# Altium project BPD597302-50M.PrjPcb
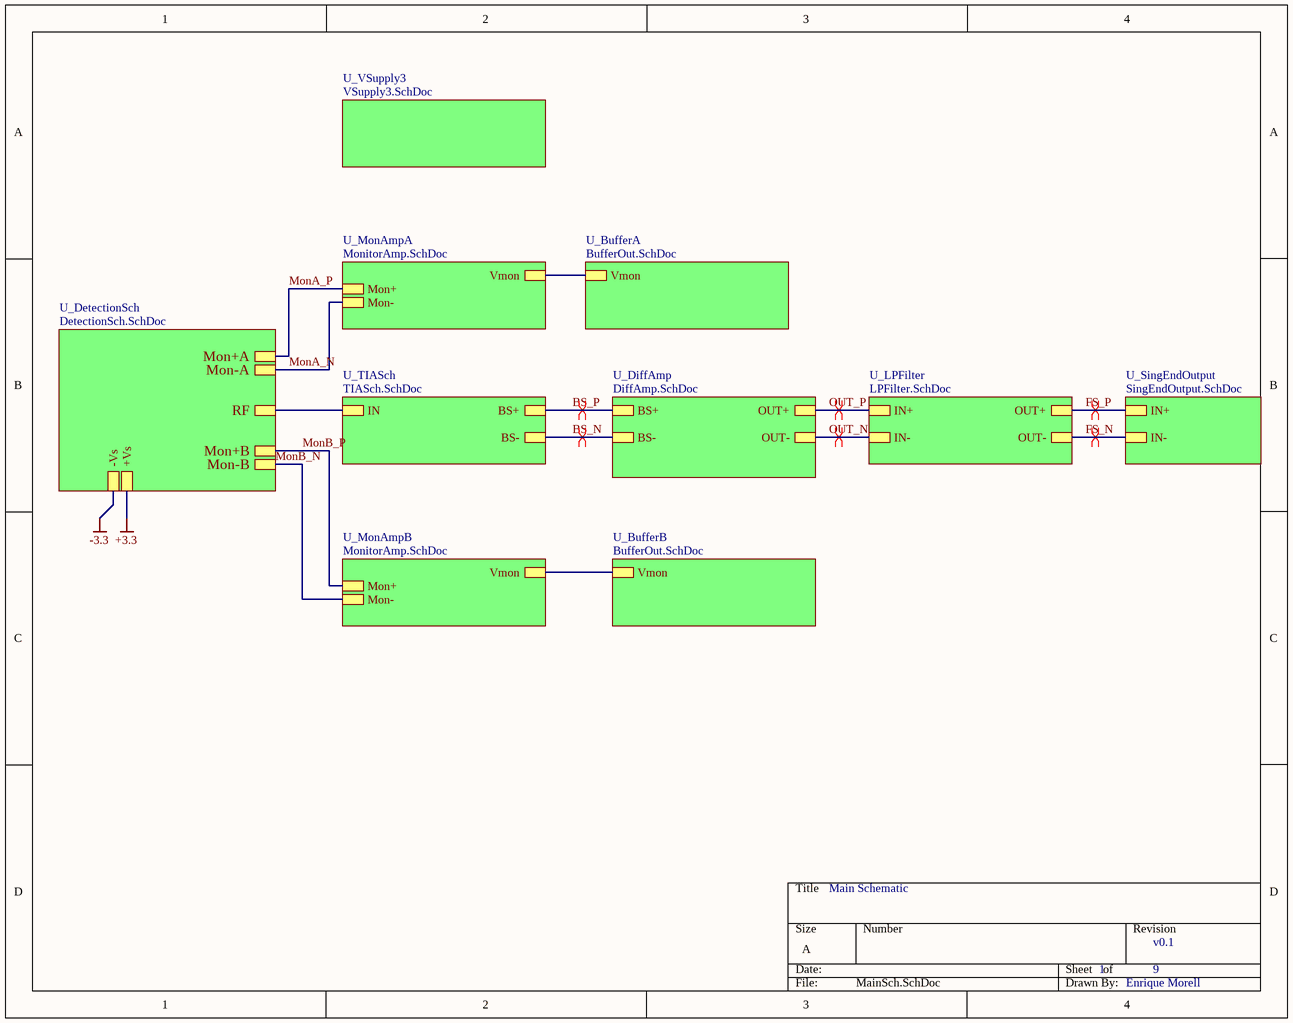
[diagram p0: MainSch.SchDoc]
Bandwidth: 50M; PD: S5973-02
9 sheets, 95 parts. Net scope: hierarchical (ports join the sheet entries above them; power ports are global).
Board file: BPD30M.PcbDoc
Sheets:
  MainSch.SchDoc
    U_DetectionSch = DetectionSch.SchDoc
    U_TIASch = TIASch.SchDoc
    U_DiffAmp = DiffAmp.SchDoc
    U_LPFilter = LPFilter.SchDoc
    U_SingEndOutput = SingEndOutput.SchDoc
    U_MonAmpA = MonitorAmp.SchDoc
    U_MonAmpB = MonitorAmp.SchDoc
    U_BufferA = BufferOut.SchDoc
    U_BufferB = BufferOut.SchDoc
    U_VSupply3 = VSupply3.SchDoc

## Sheet MainSch.SchDoc: Main Schematic
size A; DrawnBy: Enrique Morell; Engineer: Enrique Morell; DocumentNumber: 1; Revision: v0.1; SheetNumber: 1; SheetTotal: 9

### Sub-sheets
U_BufferA = BufferOut.SchDoc: Vmon
U_BufferB = BufferOut.SchDoc: Vmon
U_DetectionSch = DetectionSch.SchDoc: Mon+A, Mon-A, RF, Mon+B, Mon-B, -Vs, +Vs
U_DiffAmp = DiffAmp.SchDoc: BS-, BS+, OUT-, OUT+
U_LPFilter = LPFilter.SchDoc: IN+, IN-, OUT+, OUT-
U_MonAmpA = MonitorAmp.SchDoc: Vmon, Mon-, Mon+
U_MonAmpB = MonitorAmp.SchDoc: Vmon, Mon-, Mon+
U_SingEndOutput = SingEndOutput.SchDoc: IN+, IN-
U_TIASch = TIASch.SchDoc: IN, BS-, BS+
U_VSupply3 = VSupply3.SchDoc: no entries

### Nets
BS_N: sheet U_TIASch/BS-, sheet U_DiffAmp/BS-
BS_P: sheet U_TIASch/BS+, sheet U_DiffAmp/BS+
FS_N: sheet U_LPFilter/OUT-, sheet U_SingEndOutput/IN-
FS_P: sheet U_LPFilter/OUT+, sheet U_SingEndOutput/IN+
MonA_N: sheet U_DetectionSch/Mon-A, sheet U_MonAmpA/Mon-
MonA_P: sheet U_DetectionSch/Mon+A, sheet U_MonAmpA/Mon+
MonB_N: sheet U_DetectionSch/Mon-B, sheet U_MonAmpB/Mon-
MonB_P: sheet U_DetectionSch/Mon+B, sheet U_MonAmpB/Mon+
OUT_N: sheet U_DiffAmp/OUT-, sheet U_LPFilter/IN-
OUT_P: sheet U_DiffAmp/OUT+, sheet U_LPFilter/IN+
NetD1_3: sheet U_DetectionSch/RF, sheet U_TIASch/IN
NetU3A_6: sheet U_MonAmpA/Vmon, sheet U_BufferA/Vmon
NetU3B_6: sheet U_MonAmpB/Vmon, sheet U_BufferB/Vmon

### Layout directives
differential pair: BS_N, BS_P, FS_N, FS_P, OUT_N, OUT_P

## Sheet DetectionSch.SchDoc: Detection Section Schematics
size A; DrawnBy: Enrique Morell; DocumentNumber: 2; Revision: v0.1; SheetNumber: 2; SheetTotal: 9
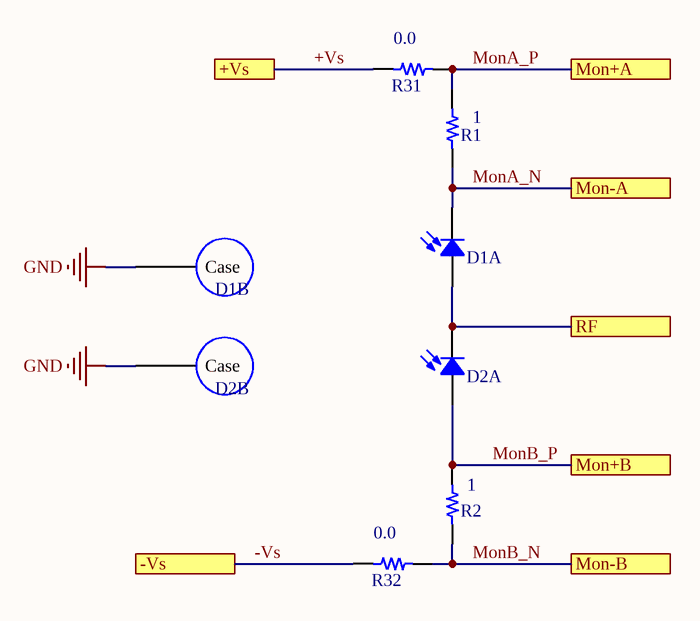
[diagram p1: DetectionSch.SchDoc]

### Parts
D1  S5973-02  [TO-18]  (value not drawn)  (parts A,B of 2)
D2  S5973-02  [TO-18]  (value not drawn)  (parts A,B of 2)
R1  1  [STACKPOLE CSR1206]
R2  1  [STACKPOLE CSR1206]
R31  0.0  [RES 0402/1005]
R32  0.0  [RES 0402/1005]

### Ports
+Vs, -Vs, Mon+A, Mon+B, Mon-A, Mon-B, RF

### Nets
+Vs: R31.1 ; port +Vs  [project net +3.3]
-Vs: R32.1 ; port -Vs  [project net -3.3]
GND: D1.2(Case) D2.2(Case)
MonA_N: D1.1 R1.2 ; port Mon-A
MonA_P: R1.1 R31.2 ; port Mon+A
MonB_N: R2.1 R32.2 ; port Mon-B
MonB_P: D2.3 R2.2 ; port Mon+B
NetD1_3: D1.3 D2.1 ; port RF

### Library data of the parts
D1 D2 = S5973-02: The S5973-02 is a high-speed Si PIN photodiode des; Manufacturer: Hamamatsu; Value: Green; Type: Through-Hole; Colour: Silver; PartId: 10872; Part Number: S5973-02; Supplier 1: Hamamatsu; Supplier Part Number 1: S5973-02; ComponentLink1Description: Datasheet; ComponentLink1URL: https://www.hamamatsu.com/resources/pdf/ssd/s5971_etc_kpin1025e.pdf; ComponentLink2Description: Hamamatsu Listing; ComponentLink2URL: https://www.hamamatsu.com/us/en/product/type/S5973-02/index.html; Price: 32; Device Package: TO-18
R1 R2 = CSR1206FK1R00: RES SMD 1 OHM 1% 1/2W 1206; Manufacturer: Stackpole Electronics Inc.; TemperatureRange: -55C ~ 155C; TemperatureCoefficient: 100ppm/C; PowerRating: 0.5W, 1/2W; Value: 1; PartId: 9988; Part Number: CSR1206FK1R00; Supplier 1: Digi-Key; Supplier Part Number 1: CSR1206FK1R00TR-ND; ComponentLink1Description: Datasheet; ComponentLink1URL: http://www.seielect.com/catalog/SEI-CSR_CSRN.pdf; ComponentLink2Description: Digi-Key Listing; ComponentLink2URL: https://www.digikey.com/product-detail/en/stackpole-electronics-inc/CSR1206FK1R00/CSR1206FK1R00TR-ND/1742410; Tolerance: 1%; Price: 0.051; Device Package: 1206 (3216 Metric)
R31 R32 = ERJ-2GE0R00X: RES SMD 0.0OHM JUMPER 1/10W 0402; Manufacturer: Panasonic Electronic Components; TemperatureRange: -55C ~ 155C; PowerRating: 0.1W, 1/10W; Value: 0.0; Part Number: ERJ-2GE0R00X; PartId: 16129; Supplier 1: Digi-Key; Supplier Part Number 1: P0.0JTR-ND; ComponentLink1Description: Datasheet; ComponentLink1URL: http://industrial.panasonic.com/www-cgi/jvcr13pz.cgi?E+PZ+3+AOA0001+ERJ2GE0R00X+7+WW; ComponentLink2Description: Digi-Key Listing; ComponentLink2URL: https://www.digikey.com/product-detail/en/panasonic-electronic-components/ERJ-2GE0R00X/P0.0JTR-ND/146727; Tolerance: Jumper; Price: 0.0029; Device Package: 0402 (1005 Metric)

## Sheet TIASch.SchDoc: Transimpedance Amplifier Schematic
size A; DrawnBy: Enrique Morell; DocumentNumber: 3; Revision: v0.1; SheetNumber: 3; SheetTotal: 9
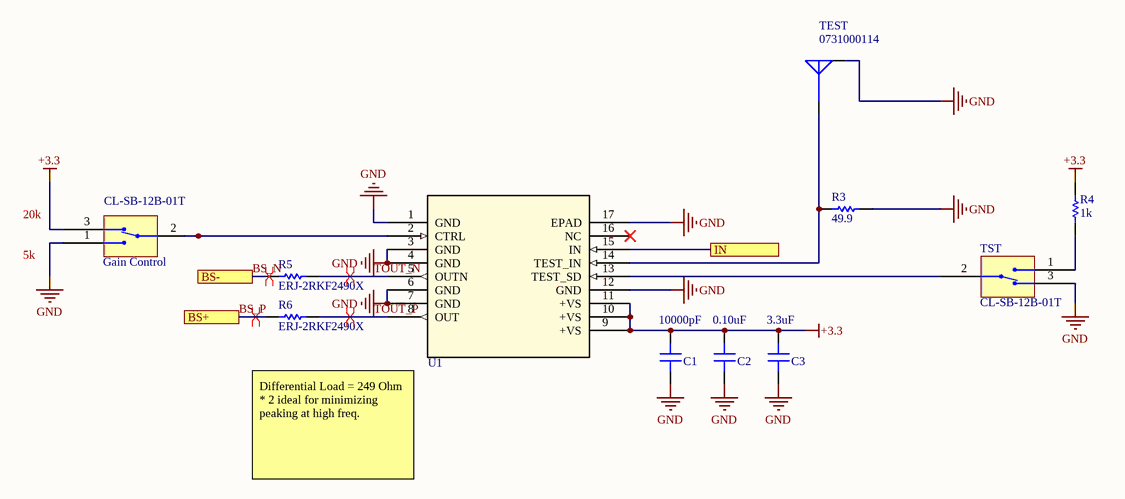
[diagram p2: TIASch.SchDoc]

### Parts
C1  10000pF  [CAP 0402/1005]
C2  0.10uF  [CAP 0402/1005]
C3  3.3uF  [CAP 0805/2012]
Gain_Control  CL-SB-12B-01T  [SW_CL-SB-12B-01]
R3  49.9  [RESC1005X40X25NL05T05]
R4  1k  [RESC1005X40X25NL05T05]
R5  ERJ-2RKF2490X  [RESC1005X40X25NL05T05]
R6  ERJ-2RKF2490X  [RESC1005X40X25NL05T05]
TEST  0731000114  [MOLEX SD-73100-0114]
TST  CL-SB-12B-01T  [SW_CL-SB-12B-01]
U1  OPA857  [TI VQFN-16 (3x3)]  (value not drawn)

### Ports
BS+, BS-, IN

### Nets
+3.3: C1.2 C2.2 C3.2 Gain_Control.3(GND) R4.1 U1.9(+VS) U1.10(+VS) U1.11(+VS)
GND: C1.1 C2.1 C3.1 Gain_Control.1(GND) R3.2 TEST.G TST.3(GND) U1.1(GND) U1.3(GND) U1.4(GND) U1.6(GND) U1.7(GND) U1.12(GND) U1.17(EPAD)
BS_N: R5.1 ; port BS-
BS_P: R6.1 ; port BS+
TOUT_N: R5.2 U1.5(OUTN)
TOUT_P: R6.2 U1.8(OUT)
NetD1_3: U1.15(IN) ; port IN
NetGain_Control_2: Gain_Control.2(GND) U1.2(CTRL)
NetR3_1: R3.1 TEST.S U1.14(TEST_IN)
NetR4_2: R4.2 TST.1(GND)
NetTST_2: TST.2(GND) U1.13(TEST_SD)

Not connected (* = marked no-connect by the designer): U1 16(NC)*

### Layout directives
differential pair: BS_N, BS_P, TOUT_N, TOUT_P

### Notes on the sheet
- 20k
- 5k
- Differential Load = 249 Ohm * 2 ideal for minimizing peaking at high freq.

### Library data of the parts
C1 = C0402C103J4RACTU: CAP CER 10000PF 16V X7R 0402; Manufacturer: Kemet; TemperatureRange: -55C ~ 125C; Tolerance: 5%; Value: 10000pF; Part Number: C0402C103J4RACTU; PartId: 12588; Supplier 1: Digi-Key; Supplier Part Number 1: 399-1039-2-ND; ComponentLink1Description: Datasheet; ComponentLink1URL: http://www.kemet.com/docfinder?Partnumber=C0402C103J4RACTU; ComponentLink2Description: Digi-Key Listing; ComponentLink2URL: https://www.digikey.com/product-detail/en/kemet/C0402C103J4RACTU/399-1039-2-ND/411041; TemperatureCoefficient: X7R; Voltage: 16V; Price: 0.0784; Device Package: 0402 (1005 Metric)
C2 = GRM155R71C104JA88D: CAP CER 0.1UF 16V X7R 0402; Manufacturer: Murata Electronics North America; TemperatureRange: -55C ~ 125C; Tolerance: 5%; Value: 0.10uF; Part Number: GRM155R71C104JA88D; PartId: 12366; Supplier 1: Digi-Key; Supplier Part Number 1: 490-6327-2-ND; ComponentLink1Description: Datasheet; ComponentLink1URL: http://www.murata.com/~/media/webrenewal/support/library/catalog/products/capacitor/mlcc/c02e.pdf; ComponentLink2Description: Digi-Key Listing; ComponentLink2URL: https://www.digikey.com/product-detail/en/murata-electronics-north-america/GRM155R71C104JA88D/490-6327-2-ND/2610891; TemperatureCoefficient: X7R; Voltage: 16V; Price: 0.0046; Device Package: 0402 (1005 Metric)
C3 = C2012X7R1C335K125AB: CAP CER 3.3UF 16V X7R 0805; Manufacturer: TDK Corporation; TemperatureRange: -55C ~ 125C; Tolerance: 10%; Value: 3.3uF; Part Number: C2012X7R1C335K125AB; PartId: 4679; Supplier 1: Digi-Key; Supplier Part Number 1: 445-7582-2-ND; ComponentLink1Description: Datasheet; ComponentLink1URL: https://product.tdk.com/info/en/catalog/datasheets/mlcc_commercial_general_en.pdf; ComponentLink2Description: Digi-Key listing; ComponentLink2URL: http://digikey.com/product-detail/en/C2012X7R1C335K125AB/445-7582-2-ND/2733017; TemperatureCoefficient: X7R; Voltage: 16V; Price: 0.1162; Type: -; Device Package: 0805 (2012 Metric)
Gain_Control TST = CL-SB-12B-01T: SWITCH SLIDE SPDT 200MA 12V; Manufacturer: Nidec Copal Electronics; Switch Function: On-On; Actuator Type: Standard; Switch Travel: 2.00mm; Mechanical Life: 10,000 Cycles; Part Number: CL-SB-12B-01T; PartId: 16472; Supplier 1: Digi-Key; Supplier Part Number 1: 563-1318-1-ND; ComponentLink1Description: Datasheet; ComponentLink1URL: https://www.nidec-copal-electronics.com/e/catalog/switch/cl-sb.pdf; ComponentLink2Description: Digi-Key Listing; ComponentLink2URL: https://www.digikey.com/product-detail/en/nidec-copal-electronics/CL-SB-12B-01T/563-1318-1-ND/3507878; Price: 0.9; TYPE: Slide Switches; Series: CL-SB; Circuit: SPDT; Operating Temperature: -40°C ~ 85°C
R3 = CMP-2002-00969-1: Manufacturer: Panasonic; Part Number: ERJ-2RKF49R9X
R4 = CMP-2002-00606-3: Chip Resistor, 1 KOhm, +/- 1%, 100 mW, -55 to 155 degC, 0402 (1005 Metric), RoHS, Tape and Reel; PartNumber: ERJ-2RKF1001X; Manufacturer: Basic Passives; Voltage Rating: 50 V; Case\/Package: 0402; Resistance: 1 KOhm; Power Rating: 100 mW; DatasheetVersion: 04/2015; Radiation Hardening: No; Pins: 2; Height: 0.35 mm; RoHSCompliant: true; Case Code (Imperial): 0402; ComponentLink2Description: Datasheet; ComponentLink1Description: Manufacturer URL; PackageReference: 0402; Mount: Surface Mount; Package Quantity: 10000; Tolerance: 1%; ComponentLink1URL: http://www.panasonic.com/; PackageDescription: 2-Pin Surface Mount Device, Body 1 x 0.5 mm; Mounting Technology: Surface Mount; Case Code (Metric): 1005; ComponentLink2URL: http://industrial.panasonic.com/cdbs/www-data/pdf/RDA0000/AOA0000C86.pdf; REACH SVHC: Yes; Packaging: Tape and Reel; Max Operating Temperature: 155 degC; Min Operating Temperature: -55 degC; Width: 0.5 mm; Length: 1 mm
R5 R6 = CMP-2002-00804-1: Manufacturer: Panasonic; Part Number: ERJ-2RKF2490X
TEST = 0731000114: CONN SMA RCPT R/A 50 OHM PCB; Manufacturer: Molex; Impedance: 50 Ohm; Body Finish: Gold; Body Material: Brass; Contact Termination: Solder; Dielectric Material: Polytetrafluoroethylene (PTFE); Voltage Rating: 500V; Center Contact Material: Gold; Center Contact Plating: Gold; ComponentLink1Description: Datasheet; ComponentLink1URL: https://www.molex.com/pdm_docs/sd/731000114_sd.pdf; ComponentLink2Description: Digi-Key Listing; ComponentLink2URL: https://www.digikey.com/product-detail/en/molex/0731000114/WM5525-ND/1465147; Fastening Type: Threaded; Housing Colour: Gold; Mounting Type: Through Hole, Right Angle; Operating Temperature: -65°C ~ 165°C; PartId: 16436; Part Number: 0731000114; Price: 5.14; Series: 73100; Shield Termination: Solder; Style: SMA; Supplier 1: Digi-Key; Supplier Part Number 1: WM5525-ND; Type: Receptacle, Female Socket
U1 = OPA857: IC OPAMP GP 1 CIRCUIT 16VQFN; Vendor: Texas Instruments; Built_By: EMA_UL_Team; Frequency - Transition: 130Mhz; Manufacturer_Part_Number: OPA857IRGTT; Copyright: Copyright (C) 2018 Accelerated Designs. All rights reserved; RefDes: RefDes; Type: DEV; Value: Value; Part Number: OPA857; PartId: 9797; Manufacturer: Texas Instruments; Supplier 1: Digi-Key; Supplier Part Number 1: 296-37283-1-ND; ComponentLink1Description: Datasheet; ComponentLink1URL: http://www.ti.com/lit/ds/symlink/opa857.pdf; ComponentLink2Description: Digi-Key Listing; ComponentLink2URL: https://www.digikey.com/product-detail/en/texas-instruments/OPA857IRGTT/296-37283-1-ND/4733032; Device Package: 16-VFQFN Exposed Pad; Price: 6.43; Series: -

## Sheet DiffAmp.SchDoc: High Speed Fully Diferential Amplifier
size A; DrawnBy: Enrique Morell; DocumentNumber: 4; Revision: v0.1; SheetNumber: 4; SheetTotal: 9
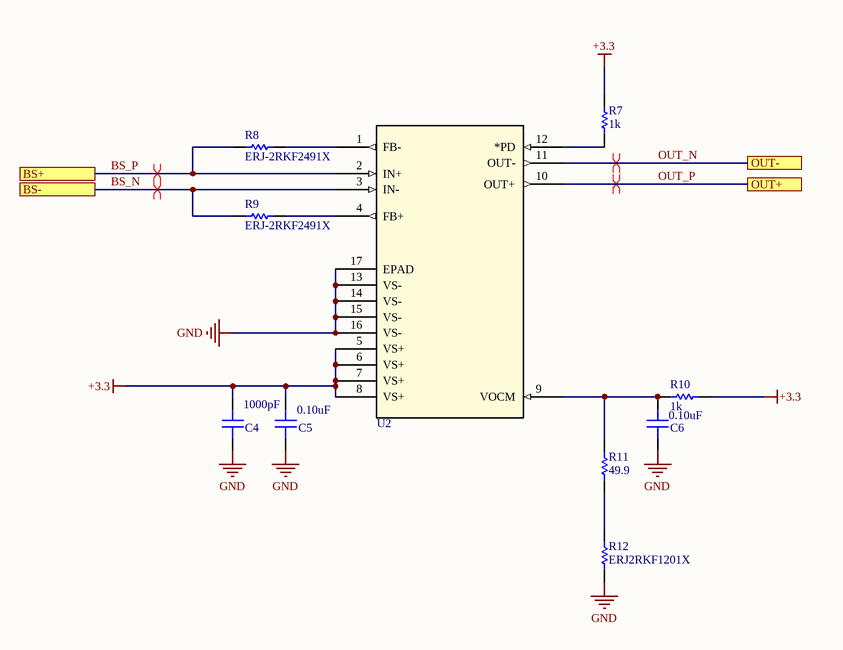
[diagram p3: DiffAmp.SchDoc]

### Parts
C4  1000pF  [CAP 0402/1005]
C5  0.10uF  [CAP 0402/1005]
C6  0.10uF  [CAP 0402/1005]
R7  1k  [RESC1005X40X25NL05T05]
R8  ERJ-2RKF2491X  [RESC1005X40X25ML05T05]
R9  ERJ-2RKF2491X  [RESC1005X40X25ML05T05]
R10  1k  [RESC1005X40X25NL05T05]
R11  49.9  [RESC1005X40X25NL05T05]
R12  ERJ2RKF1201X  [RESC1005X40X25ML05T05]
U2  THS4541IRGTT  [TI VQFN-16 (3x3)]  (value not drawn)

### Ports
BS+, BS-, OUT+, OUT-

### Nets
+3.3: C4.2 C5.2 R7.2 R10.1 U2.5(VS+) U2.6(VS+) U2.7(VS+) U2.8(VS+)
GND: C4.1 C5.1 C6.1 R12.1 U2.13(VS-) U2.14(VS-) U2.15(VS-) U2.16(VS-) U2.17(EPAD)
BS_N: R9.1 U2.3(IN-) ; port BS-
BS_P: R8.1 U2.2(IN+) ; port BS+
OUT_N: U2.11(OUT-) ; port OUT-
OUT_P: U2.10(OUT+) ; port OUT+
NetC6_2: C6.2 R10.2 R11.2 U2.9(VOCM)
NetR7_1: R7.1 U2.12(*PD)
NetR8_2: R8.2 U2.1(FB-)
NetR9_2: R9.2 U2.4(FB+)
NetR11_1: R11.1 R12.2

### Layout directives
differential pair: BS_N, BS_P, OUT_N, OUT_P

### Library data of the parts
C4 = C0402C102K3RACTU: CAP CER 1000PF 25V X7R 0402; Manufacturer: Kemet; TemperatureRange: -55C ~ 125C; Tolerance: 10%; Value: 1000pF; Part Number: C0402C102K3RACTU; PartId: 12420; Supplier 1: Digi-Key; Supplier Part Number 1: 399-1031-2-ND; ComponentLink1Description: Datasheet; ComponentLink1URL: http://www.kemet.com/docfinder?Partnumber=C0402C102K3RACTU; ComponentLink2Description: Digi-Key Listing; ComponentLink2URL: https://www.digikey.com/product-detail/en/kemet/C0402C102K3RACTU/399-1031-2-ND/411033; TemperatureCoefficient: X7R; Voltage: 25V; Price: 0.0037; Device Package: 0402 (1005 Metric)
C5 C6 = GRM155R71C104JA88D: as C2 on sheet TIASch; Value: 0.10uF; Part Number: GRM155R71C104JA88D; PartId: 12366; Supplier 1: Digi-Key; Supplier Part Number 1: 490-6327-2-ND; ComponentLink1Description: Datasheet; ComponentLink1URL: http://www.murata.com/~/media/webrenewal/support/library/catalog/products/capacitor/mlcc/c02e.pdf; ComponentLink2Description: Digi-Key Listing; ComponentLink2URL: https://www.digikey.com/product-detail/en/murata-electronics-north-america/GRM155R71C104JA88D/490-6327-2-ND/2610891; TemperatureCoefficient: X7R; Voltage: 16V; Price: 0.0046; Device Package: 0402 (1005 Metric)
R7 R10 = CMP-2002-00606-3: as R4 on sheet TIASch; DatasheetVersion: 04/2015; Radiation Hardening: No; Pins: 2; Height: 0.35 mm; RoHSCompliant: true; Case Code (Imperial): 0402; ComponentLink2Description: Datasheet; ComponentLink1Description: Manufacturer URL; PackageReference: 0402; Mount: Surface Mount; Package Quantity: 10000; Tolerance: 1%; ComponentLink1URL: http://www.panasonic.com/; PackageDescription: 2-Pin Surface Mount Device, Body 1 x 0.5 mm; Mounting Technology: Surface Mount; Case Code (Metric): 1005; ComponentLink2URL: http://industrial.panasonic.com/cdbs/www-data/pdf/RDA0000/AOA0000C86.pdf; REACH SVHC: Yes; Packaging: Tape and Reel; Max Operating Temperature: 155 degC; Min Operating Temperature: -55 degC; Width: 0.5 mm; Length: 1 mm
R8 = CMP-2002-00805-1: Manufacturer: Panasonic; Part Number: ERJ-2RKF2491X
R9 = CMP-2002-00805-1: 2.49k; Manufacturer: Panasonic; Part Number: ERJ-2RKF2491X
R11 = CMP-2002-00969-1: as R3 on sheet TIASch
R12 = CMP-2002-01123-1: Manufacturer: Panasonic; Part Number: ERJ2RKF1201X
U2 = THS4541IRGTT: IC OPAMP DIFF 1 CIRCUIT 16VQFN; Built_By: EMA_UL_Team; Vendor: Texas Instruments; Frequency - Transition: 850Mhz; Manufacturer_Part_Number: THS4541IRGTT; Copyright: Copyright (C) 2018 Accelerated Designs. All rights reserved; RefDes: RefDes; Type: DEV; Value: Value; Part Number: THS4541IRGTT; PartId: 9798; Manufacturer: Texas Instruments; Supplier 1: Digi-Key; Supplier Part Number 1: 296-38343-1-ND; ComponentLink1Description: Datasheet; ComponentLink1URL: http://www.ti.com/lit/ds/symlink/ths4541.pdf; ComponentLink2Description: Digi-Key Listing; ComponentLink2URL: https://www.digikey.com/product-detail/en/texas-instruments/THS4541IRGTT/296-38343-1-ND/4968310; Device Package: 16-VFQFN Exposed Pad; Price: 6.57

## Sheet LPFilter.SchDoc: Differential 7th order LP Filter Sch
size A; DrawnBy: Enrique Morell; DocumentNumber: 5; SheetNumber: 5; SheetTotal: 9
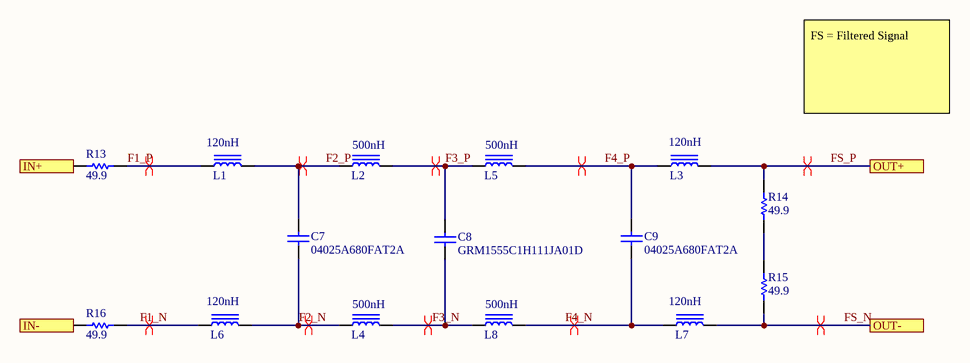
[diagram p4: LPFilter.SchDoc]

### Parts
C7  04025A680FAT2A  [CAPC1005X56X25NL10T15]
C8  GRM1555C1H111JA01D  [CAPC1005X55X25LL05T10]
C9  04025A680FAT2A  [CAPC1005X56X25NL10T15]
L1  120nH  [FER 0805/2012]
L2  500nH  [CAP 1210/3225 - 1.2MM]
L3  120nH  [FER 0805/2012]
L4  500nH  [CAP 1210/3225 - 1.2MM]
L5  500nH  [CAP 1210/3225 - 1.2MM]
L6  120nH  [FER 0805/2012]
L7  120nH  [FER 0805/2012]
L8  500nH  [CAP 1210/3225 - 1.2MM]
R13  49.9  [RESC1005X40X25NL05T05]
R14  49.9  [RESC1005X40X25NL05T05]
R15  49.9  [RESC1005X40X25NL05T05]
R16  49.9  [RESC1005X40X25NL05T05]

### Ports
IN+, IN-, OUT+, OUT-

### Nets
F1_N: L6.1 R16.2
F1_P: L1.1 R13.2
F2_N: C7.2 L4.1 L6.2
F2_P: C7.1 L1.2 L2.1
F3_N: C8.1 L4.2 L8.1
F3_P: C8.2 L2.2 L5.1
F4_N: C9.1 L7.1 L8.2
F4_P: C9.2 L3.1 L5.2
FS_N: L7.2 R15.1 ; port OUT-
FS_P: L3.2 R14.2 ; port OUT+
OUT_N: R16.1 ; port IN-
OUT_P: R13.1 ; port IN+
NetR14_1: R14.1 R15.2

### Layout directives
differential pair: F1_N, F1_P, F2_N, F2_P, F3_N, F3_P, F4_N, F4_P, FS_N, FS_P

### Notes on the sheet
- FS = Filtered Signal

### Library data of the parts
C7 C9 = CMP-2008-02674-1: Manufacturer: AVX Interconnect / Elco; Part Number: 04025A680FAT2A
C8 = CMP-2008-04257-1: Manufacturer: Murata; Part Number: GRM1555C1H111JA01D
L1 L3 L6 L7 = MLF2012DR12M: FIXED IND 120NH 300MA 200 MOHM; Manufacturer: TDK Corporation; TemperatureRange: -55°C ~ 125°C; Tolerance: 20%; Type: Multilayer; Q at Frequency: 20 @ 25MHz; DC Resistance: 200mOhm Max; Shielding: Shielded; ComponentLink2Description: Digi-Key listing; ComponentLink1URL: https://product.tdk.com/info/en/catalog/datasheets/inductor_commercial_standard_mlf2012_en.pdf; ComponentLink1Description: Datasheet; ComponentLink2URL: https://www.digikey.com/product-detail/en/tdk-corporation/MLF2012DR12M/445-8984-1-ND/3641578; Value: 120nH; Part Number: MLF2012DR12M; PartId: 6444; Supplier 1: Digi-Key; Supplier Part Number 1: 445-8984-1-ND; Price: 0.18; Device Package: 0805 (2012 Metric)
L2 L4 L5 L8 = 74479899150: FIXED IND 500NH 3.8A 18 MOHM SMD; Manufacturer: Wurth Electronics Inc.; TemperatureRange: -40°C ~ 125°C; Tolerance: 20%; Type: Multilayer; Q at Frequency: 22 @ 1MHz; DC Resistance: 18mOhm; Shielding: Shielded; Value: 500nH; Part Number: 74479899150; PartId: 6443; Supplier 1: Digi-Key; Supplier Part Number 1: 732-7339-6-ND; ComponentLink1Description: Datasheet; ComponentLink1URL: https://katalog.we-online.de/pbs/datasheet/74479899150.pdf; ComponentLink2Description: Digi-Key listing; ComponentLink2URL: https://www.digikey.com/product-detail/en/wurth-electronics-inc/74479899150/732-7339-6-ND/5353481; Price: 1.13; Device Package: 1210 (3225 Metric)
R13-R16 = CMP-2002-00969-1: as R3 on sheet TIASch

## Sheet SingEndOutput.SchDoc: AC Coupled Output Schematic
size A; DrawnBy: Enrique Morell; DocumentNumber: 9; Revision: v0.1; SheetNumber: 9; SheetTotal: 9
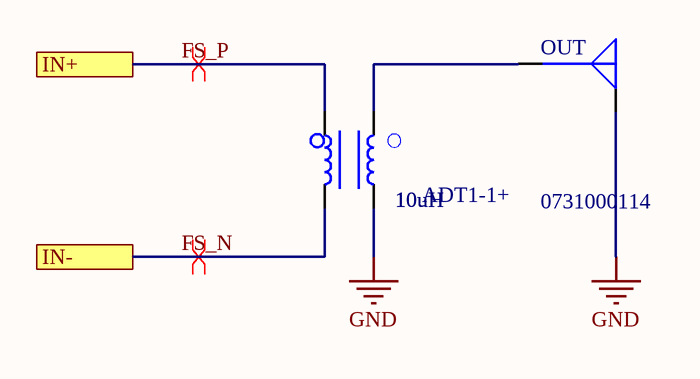
[diagram p5: SingEndOutput.SchDoc]

### Parts
OUT  0731000114  [MOLEX SD-73100-0114]
XRF  ADT1-1+  Inductance A: 10uH  Coupling Factor: 1  [ADT1-1+]

### Ports
IN+, IN-

### Nets
GND: OUT.G XRF.6
FS_N: XRF.1 ; port IN-
FS_P: XRF.3 ; port IN+
NetOUT_S: OUT.S XRF.4

### Layout directives
differential pair: FS_N, FS_P

### Library data of the parts
OUT = 0731000114: as TEST on sheet TIASch; Center Contact Material: Gold; Center Contact Plating: Gold; ComponentLink1Description: Datasheet; ComponentLink1URL: https://www.molex.com/pdm_docs/sd/731000114_sd.pdf; ComponentLink2Description: Digi-Key Listing; ComponentLink2URL: https://www.digikey.com/product-detail/en/molex/0731000114/WM5525-ND/1465147; Fastening Type: Threaded; Housing Colour: Gold; Mounting Type: Through Hole, Right Angle; Operating Temperature: -65°C ~ 165°C; PartId: 16436; Part Number: 0731000114; Price: 5.14; Series: 73100; Shield Termination: Solder; Style: SMA; Supplier 1: Digi-Key; Supplier Part Number 1: WM5525-ND; Type: Receptacle, Female Socket
XRF = ADT1-1+: RF XFMR 50Ohm / SURF MOUNT / RoHS; Manufacturer: Mini-Circuits; Part Number: ADT1-1+; PartId: 21136; Supplier 1: Mini-Circuits; Supplier Part Number 1: ADT1-1+; ComponentLink1Description: Datasheet; ComponentLink1URL: https://www.minicircuits.com/pdfs/ADT1-1+.pdf; ComponentLink2Description: Mini-Circuit Listing; ComponentLink2URL: https://www.minicircuits.com/WebStore/dashboard.html?model=ADT1-1%2B; Inductance B: 10uH

## Sheet MonitorAmp.SchDoc: Current Sensing Amplifier for Monitor Outputs (slow)
size A; Author: Enrique Morell; DrawnBy: Enrique Morell; Engineer: Enrique Morell; DocumentNumber: 6; Revision: v0.1; SheetNumber: 6; SheetTotal: 9
Used 2 times, as channels U_MonAmpA, U_MonAmpB. Parts and nets are listed once, with the designators drawn on the sheet.
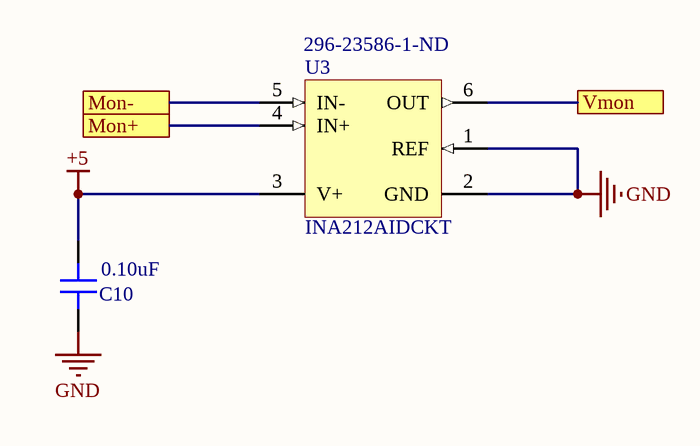
[diagram p6: MonitorAmp.SchDoc]

### Parts
C10  0.10uF  [CAP 0402/1005]
U3  INA212AIDCKT  Supplier Part Number 1: 296-23586-1-ND  [DCK0006A_L]

### Ports
Mon+, Mon-, Vmon

### Nets
+5: C10.2 U3.3(V+)
GND: C10.1 U3.1(REF) U3.2(GND)
Mon+: U3.4(IN+) ; port Mon+
Mon-: U3.5(IN-) ; port Mon-
Vmon: U3.6(OUT) ; port Vmon

### Channels
U_MonAmpA: designators end in A; ports Mon+=MonA_P Mon-=MonA_N Vmon=NetU3A_6
U_MonAmpB: designators end in B; ports Mon+=MonB_P Mon-=MonB_N Vmon=NetU3B_6

### Library data of the parts
C10 = GRM155R71C104JA88D: as C2 on sheet TIASch; Value: 0.10uF; Part Number: GRM155R71C104JA88D; PartId: 12366; Supplier 1: Digi-Key; Supplier Part Number 1: 490-6327-2-ND; ComponentLink1Description: Datasheet; ComponentLink1URL: http://www.murata.com/~/media/webrenewal/support/library/catalog/products/capacitor/mlcc/c02e.pdf; ComponentLink2Description: Digi-Key Listing; ComponentLink2URL: https://www.digikey.com/product-detail/en/murata-electronics-north-america/GRM155R71C104JA88D/490-6327-2-ND/2610891; TemperatureCoefficient: X7R; Voltage: 16V; Price: 0.0046; Device Package: 0402 (1005 Metric)
U3 = CMP-2000-06456-1: Voltage Output, High / Low-Side Measurement, Bi-Directional Zero-Drift Series, Current Shunt Monitor, 2.7 to 26 V, -40 to 125 degC, 6-Pin SOT-23 (DCK6), Green (RoHS & no Sb/Br), Tape and Reel; Manufacturer 1: Texas Instruments; Package Version: 4093553-4/G, 01/2007; Development Kit: INA210-214EVM; Unit Weight: 0.000088oz; Vcm - Common Mode Voltage: -0.3Vto+26V; Gain V/V: 100V/V; Operating Supply Current: 115uA; Topology: CurrentShuntFeedback; Number of Channels: 1Channel; Accuracy: 1%; Amplifier Type: CurrentSense; Gain Error: 0.02%; Vos - Input Offset Voltage: 60uV; Brand: TexasInstruments; Supply Voltage - Max: 26V; CMRR - Common Mode Rejection Ratio: 105dB; Supply Voltage - Min: 2.7V; GBP - Gain Bandwidth Product: 30kHz; Input Offset Voltage (Vos): 35uV; Input Bias Current: 35uA; Gain Bandwidth Product: 4kHz; Unity Gain Bandwidth Product: 14kHz; Nominal Supply Current: 65uA; Number of Elements: 1; Voltage Gain: 60dB; Power Supply Rejection Ratio (PSRR): 140dB; Slew Rate: 0.04V/µs; Operating Supply Voltage: 24V; Min Input Voltage: -300mV; Product Category: CurrentSenseAmplifiers; Series: INA214; Mounting Style: SMD/SMT; Datasheet URL: http://www.ti.com/lit/gpn/INA214?keyMatch=INA214AIDCKT&tisearch=Search-EN-Everything; Maximum Operating Temperature: +125C; Package / Case: SOT-23-6; Minimum Operating Temperature: -40C; Datasheet Version: Rev. G, 07/2014; RoHS: True; Manufacturer URL: http://www.ti.com/; Package Description: 6-Pin Plastic Small Outline, Body 2 x 1.25 mm, Pitch 0.65 mm; Product: CurrentSenseAmplifiers; Package Reference: DCK6; Packaging: Reel; Manufacturer: TexasInstruments; Mounting Technology: SurfaceMount; Supplier 1: Digi-Key; Manufacturer Part Number 1: INA212AIDCKT; Stock 1: 3857; Pricing 1: 1=1.54000, 10=1.38100, 100=1.11010 (USD); Mount: Surface Mount; Case/Package: SC; Number of Pins: 6; Weight: 8.8E-05oz; Min Operating Temperature: -40°C; Max Operating Temperature: 125°C; Package Quantity: 1; Max Supply Voltage: 26V; Min Supply Voltage: 2.7V; Common Mode Rejection Ratio: 105dB; Bandwidth: 14kHz; Max Input Voltage: 26V; Number of Amplifiers: 1; Termination: SMD/SMT; Length: 2mm; Height: 0.9mm; Width: 1.25mm; Radiation Hardening: No; Lead Free: Lead Free; REACH SVHC: No SVHC; ComponentLink1URL: https://datasheet.ciiva.com/15132/getdatasheetpartid-49972-15132526.pdf?src-supplier=Verical; ComponentLink1Description: https://datasheet.ciiva.com/15132/getdatasheetpartid-49972-15132526.pdf?src-supplier=Verical; ComponentLink2URL: https://datasheet.ciiva.com/2978/ina213-2978003.pdf?src-supplier=Avnet; ComponentLink2Description: https://datasheet.ciiva.com/2978/ina213-2978003.pdf?src-supplier=Avnet; ComponentLink3URL: https://datasheet.ciiva.com/2976/ina213-2976375.pdf?src-supplier=Avnet; ComponentLink3Description: https://datasheet.ciiva.com/2976/ina213-2976375.pdf?src-supplier=Avnet; ComponentLink4URL: https://datasheet.ciiva.com/1484/1848953-1484619.pdf?src-supplier=Element14; ComponentLink4Description: https://datasheet.ciiva.com/1484/1848953-1484619.pdf?src-supplier=Element14; ComponentLink5URL: https://datasheet.ciiva.com/1939/ina211-1939836.pdf?src-supplier=Digi-Key; ComponentLink5Description: https://datasheet.ciiva.com/1939/ina211-1939836.pdf?src-supplier=Digi-Key; ComponentLink6URL: https://datasheet.ciiva.com/1939/ina211-1939837.pdf?src-supplier=Digi-Key; ComponentLink6Description: https://datasheet.ciiva.com/1939/ina211-1939837.pdf?src-supplier=Digi-Key; ComponentLink7URL: https://datasheet.ciiva.com/1939/ina211-1939838.pdf?src-supplier=Digi-Key; ComponentLink7Description: https://datasheet.ciiva.com/1939/ina211-1939838.pdf?src-supplier=Digi-Key

## Sheet BufferOut.SchDoc: Monitor Outputs Amplification and Buffering
size A; DrawnBy: Enrique Morell; DocumentNumber: 7; Revision: v0.1; SheetNumber: 7; SheetTotal: 9
Used 2 times, as channels U_BufferA, U_BufferB. Parts and nets are listed once, with the designators drawn on the sheet.
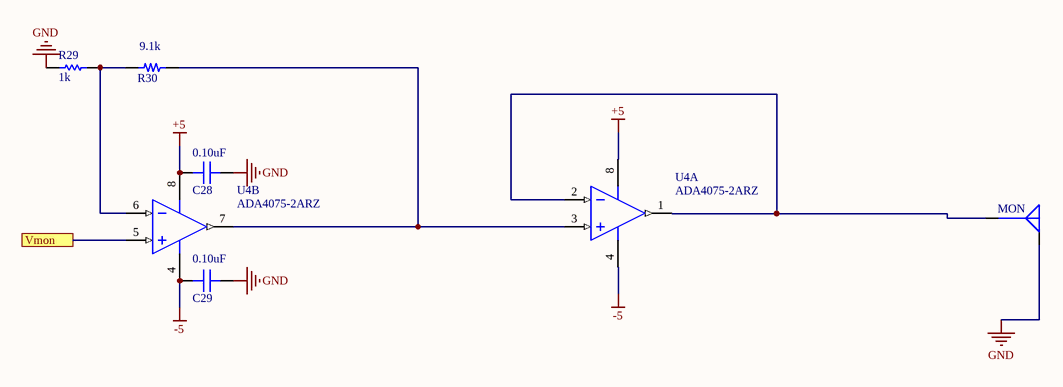
[diagram p7: BufferOut.SchDoc]

### Parts
C28  0.10uF  [CAP 0402/1005]
C29  0.10uF  [CAP 0402/1005]
MON  0731000114  [MOLEX SD-73100-0114]  (value not drawn)
R29  1k  [RESC1005X40X25NL05T05]
R30  9.1k  [RES 0402/1005]
U4  ADA4075-2ARZ  [ADI-R-8_N]  (parts A,B of 2)

### Ports
Vmon

### Nets
+5: C28.2 U4.8(+V)
-5: C29.2 U4.4(-V)
GND: C28.1 C29.1 MON.G R29.1
Vmon: U4.5(+IN_B) ; port Vmon
NetMON_S: MON.S U4.1(OUT_A) U4.2(-IN_A)
NetR29_2: R29.2 R30.1 U4.6(-IN_B)
NetR30_2: R30.2 U4.3(+IN_A) U4.7(OUT_B)

### Channels
U_BufferA: designators end in A; ports Vmon=NetU3A_6
U_BufferB: designators end in B; ports Vmon=NetU3B_6

### Library data of the parts
C28 C29 = GRM155R71C104JA88D: as C2 on sheet TIASch; Value: 0.10uF; Part Number: GRM155R71C104JA88D; PartId: 12366; Supplier 1: Digi-Key; Supplier Part Number 1: 490-6327-2-ND; ComponentLink1Description: Datasheet; ComponentLink1URL: http://www.murata.com/~/media/webrenewal/support/library/catalog/products/capacitor/mlcc/c02e.pdf; ComponentLink2Description: Digi-Key Listing; ComponentLink2URL: https://www.digikey.com/product-detail/en/murata-electronics-north-america/GRM155R71C104JA88D/490-6327-2-ND/2610891; TemperatureCoefficient: X7R; Voltage: 16V; Price: 0.0046; Device Package: 0402 (1005 Metric)
MON = 0731000114: as TEST on sheet TIASch; Center Contact Material: Gold; Center Contact Plating: Gold; ComponentLink1Description: Datasheet; ComponentLink1URL: https://www.molex.com/pdm_docs/sd/731000114_sd.pdf; ComponentLink2Description: Digi-Key Listing; ComponentLink2URL: https://www.digikey.com/product-detail/en/molex/0731000114/WM5525-ND/1465147; Fastening Type: Threaded; Housing Colour: Gold; Mounting Type: Through Hole, Right Angle; Operating Temperature: -65°C ~ 165°C; PartId: 16436; Part Number: 0731000114; Price: 5.14; Series: 73100; Shield Termination: Solder; Style: SMA; Supplier 1: Digi-Key; Supplier Part Number 1: WM5525-ND; Type: Receptacle, Female Socket
R29 = CMP-2002-00606-3: as R4 on sheet TIASch; DatasheetVersion: 04/2015; Radiation Hardening: No; Pins: 2; Height: 0.35 mm; RoHSCompliant: true; Case Code (Imperial): 0402; ComponentLink2Description: Datasheet; ComponentLink1Description: Manufacturer URL; PackageReference: 0402; Mount: Surface Mount; Package Quantity: 10000; Tolerance: 1%; ComponentLink1URL: http://www.panasonic.com/; PackageDescription: 2-Pin Surface Mount Device, Body 1 x 0.5 mm; Mounting Technology: Surface Mount; Case Code (Metric): 1005; ComponentLink2URL: http://industrial.panasonic.com/cdbs/www-data/pdf/RDA0000/AOA0000C86.pdf; REACH SVHC: Yes; Packaging: Tape and Reel; Max Operating Temperature: 155 degC; Min Operating Temperature: -55 degC; Width: 0.5 mm; Length: 1 mm
R30 = ERJ-2RKF9101X: RES SMD 9.1K OHM 1% 1/10W 0402; Manufacturer: Panasonic Electronic Components; TemperatureRange: -55C ~ 155C; TemperatureCoefficient: 100ppm/C; PowerRating: 0.1W, 1/10W; Value: 9.1k; Part Number: ERJ-2RKF9101X; PartId: 273; Supplier 1: Digi-Key; Supplier Part Number 1: P9.10KLTR-ND; ComponentLink1Description: Datasheet; ComponentLink1URL: http://industrial.panasonic.com/www-cgi/jvcr13pz.cgi?E+PZ+3+AOA0002+ERJ2RKF9101X+7+WW; ComponentLink2Description: Digikey listing; ComponentLink2URL: http://digikey.com/product-detail/en/ERJ-2RKF9101X/P9.10KLTR-ND/1746291; Tolerance: 1%; Price: 0.0043; Type: Thick Film; Device Package: 0402 (1005 Metric)
U4 = CMP-0384-00855-1: Double Channel Ultra Low Noise Operational Amplifier, 6.5 MHz BW, 12 V/us SR, Industrial, 8-pin SOIC (R-8), Tube; Manufacturer: Analog Devices; V Span Max: 36V; Small Signal Bandwidth: 6.5MHz; Input Bias Current: 30nA; V Span Min: 24V; Amplifiers Per Package: 2; Input Offset Voltage: 300uV; Slew Rate: 12V/us; Iq/Amp: 1.8mA; DatasheetVersion: Rev. B; PackageDescription: 8-Pin Standard Small Outline Package, Body 3.9 x 4.9 mm, Pitch 1.27 mm; Generic Part Number: ADA4075-2; PackageReference: R-8; ComponentLink3URL: http://www.analog.com/static/imported-files/packages/PKG_PDF/SOIC_Narrow%20(R)/R_8.pdf; ComponentLink2URL: http://www.analog.com/static/imported-files/data_sheets/ADA4075-2.pdf; ComponentLink3Description: Package Specification; ComponentLink1Description: Manufacturer URL; PartNumber: ADA4075-2ARZ; PackageVersion: 060506-A; ComponentLink2Description: Datasheet; Code_JEDEC: MS-012-AA; ComponentLink1URL: http://www.analog.com/en/index.html; Mounting Technology: Surface Mount

## Sheet VSupply3.SchDoc: Voltage Supply Shchematic
size A; DrawnBy: Enrique Morell; DocumentNumber: 8; Revision: v0.1; SheetNumber: 8; SheetTotal: 9
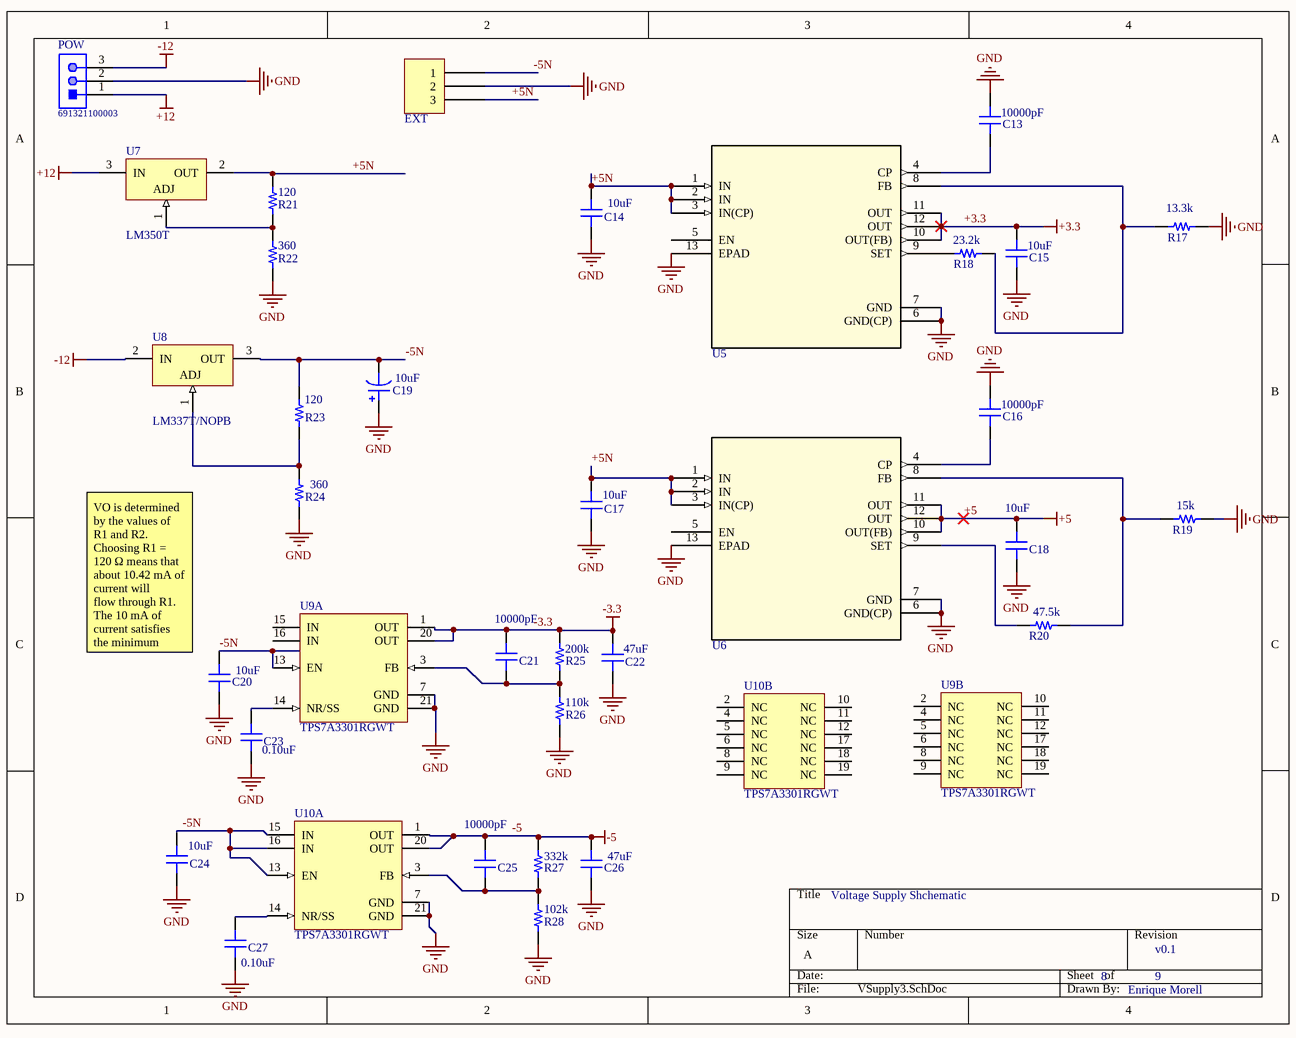
[diagram p8: VSupply3.SchDoc]

### Parts
C13  10000pF  [CAP 0402/1005]
C14  10uF  [CAP 1210/3225 - 2.8MM]
C15  10uF  [CAP 1210/3225 - 2.8MM]
C16  10000pF  [CAP 0402/1005]
C17  10uF  [CAP 1210/3225 - 2.8MM]
C18  10uF  [CAP 1210/3225 - 2.8MM]
C19  10uF  [CAP POL 2917/7343]
C20  10uF  [CAP 1210/3225 - 2.8MM]
C21  10000pF  [CAP 0402/1005]
C22  47uF  [CAP 1206/3216]
C23  0.10uF  [CAP 0402/1005]
C24  10uF  [CAP 1210/3225 - 2.8MM]
C25  10000pF  [CAP 0402/1005]
C26  47uF  [CAP 1206/3216]
C27  0.10uF  [CAP 0402/1005]
EXT  0022272031  [MOLEX KK 0022272031]  (value not drawn)
POW  691321100003  [691321100003]
R17  13.3k  [RES 0402/1005]
R18  23.2k  [RES 0402/1005]
R19  15k  [RES 0402/1005]
R20  47.5k  [RES 0402/1005]
R21  120  [RES 0402/1005]
R22  360  [RES 0402/1005]
R23  120  [RES 0402/1005]
R24  360  [RES 0402/1005]
R25  200k  [RES 0402/1005]
R26  110k  [RES 0402/1005]
R27  332k  [RES 0402/1005]
R28  102k  [RES 0402/1005]
U5  LP38798SDE-ADJ/NOPB  [TI WSON-12 DNT]  (value not drawn)
U6  LP38798SDE-ADJ/NOPB  [TI WSON-12 DNT]  (value not drawn)
U7  LM350T  [NDE0003A]
U8  LM337T/NOPB  [NDE0003A]
U9  TPS7A3301RGWT  [RGW0020A_V]  (parts A,B of 2)
U10  TPS7A3301RGWT  [RGW0020A_V]  (parts A,B of 2)

### Nets
+3.3: C15.2 U5.10(OUT(FB)) U5.11(OUT) U5.12(OUT)
+5: C18.2 U6.10(OUT(FB)) U6.11(OUT) U6.12(OUT)
+12: POW.1 U7.3(IN)
-3.3: C21.1 C22.2 R25.2 U9.1(OUT) U9.20(OUT)
-5: C25.1 C26.2 R27.2 U10.1(OUT) U10.20(OUT)
-12: POW.3 U8.2(IN)
GND: C13.2 C14.1 C15.1 C16.2 C17.1 C18.1 C19.1 C20.1 C22.1 C23.1 C24.1 C26.1 C27.1 EXT.2 POW.2 R17.2 R19.2 R22.1 R24.1 R26.1 R28.1 U5.6(GND(CP)) U5.7(GND) U5.13(EPAD) U6.6(GND(CP)) U6.7(GND) U6.13(EPAD) U9.7(GND) U9.21(GND) U10.7(GND) U10.21(GND)
+5N: C14.2 C17.2 EXT.3 R21.2 U5.1(IN) U5.2(IN) U5.3(IN(CP)) U6.1(IN) U6.2(IN) U6.3(IN(CP)) U7.2(OUT)
-5N: C19.2 C20.2 C24.2 EXT.1 R23.2 U8.3(OUT) U9.13(EN) U10.13(EN) U10.15(IN) U10.16(IN)
NetC13_1: C13.1 U5.4(CP)
NetC16_1: C16.1 U6.4(CP)
NetC21_2: C21.2 R25.1 R26.2 U9.3(FB)
NetC23_2: C23.2 U9.14(NR/SS)
NetC25_2: C25.2 R27.1 R28.2 U10.3(FB)
NetC27_2: C27.2 U10.14(NR/SS)
NetR17_1: R17.1 R18.2 U5.8(FB)
NetR18_1: R18.1 U5.9(SET)
NetR19_1: R19.1 R20.2 U6.8(FB)
NetR20_1: R20.1 U6.9(SET)
NetR21_1: R21.1 R22.2 U7.1(ADJ)
NetR23_1: R23.1 R24.2 U8.1(ADJ)

Not connected (* = marked no-connect by the designer): U5 5(EN); U6 5(EN); U9 2(NC) 4(NC) 5(NC) 6(NC) 8(NC) 9(NC) 10(NC) 11(NC) 12(NC) 15(IN) 16(IN) 17(NC) 18(NC) 19(NC); U10 2(NC) 4(NC) 5(NC) 6(NC) 8(NC) 9(NC) 10(NC) 11(NC) 12(NC) 17(NC) 18(NC) 19(NC)

### Notes on the sheet
- (near C20) VO is determined by the values of R1 and R2. Choosing R1 = 120 Ω means that about 10.42 mA of current will
  flow through R1. The 10 mA of current satisfies the minimum operating current and renders IREF negligible.
  Since the current is coming from ground, the same amount of current will flow through R2. Therefore, the size of
  R2 will be the dominant factor in adjusting VO. The relationship between R1, R2, and VO is as follows:
  where VO is the output in volts.

### Library data of the parts
C13 C16 C21 C25 = C0402C103J4RACTU: as C1 on sheet TIASch; Value: 10000pF; Part Number: C0402C103J4RACTU; PartId: 12588; Supplier 1: Digi-Key; Supplier Part Number 1: 399-1039-2-ND; ComponentLink1Description: Datasheet; ComponentLink1URL: http://www.kemet.com/docfinder?Partnumber=C0402C103J4RACTU; ComponentLink2Description: Digi-Key Listing; ComponentLink2URL: https://www.digikey.com/product-detail/en/kemet/C0402C103J4RACTU/399-1039-2-ND/411041; TemperatureCoefficient: X7R; Voltage: 16V; Price: 0.0784; Device Package: 0402 (1005 Metric)
C14 C15 C17 C18 C20 C24 = CL32B106KAJNNNE: CAP CER 10UF 25V X7R 1210; Manufacturer: Samsung Electro-Mechanics America, Inc.; TemperatureRange: -55C ~ 125C; Tolerance: 10%; Value: 10uF; Part Number: CL32B106KAJNNNE; PartId: 19187; Supplier 1: Digi-Key; Supplier Part Number 1: 1276-1807-2-ND; ComponentLink1Description: Datasheet; ComponentLink1URL: http://www.samsungsem.com/kr/front/downloadcms.do?path=/kr/support/product-search/mlcc/__icsFiles/afieldfile/2014/11/05&fileName=C_CL32B106KAJNNNE.pdf; ComponentLink2Description: Digi-Key Listing; ComponentLink2URL: https://www.digikey.com/product-detail/en/samsung-electro-mechanics-america-inc/CL32B106KAJNNNE/1276-1807-2-ND/3887465; TemperatureCoefficient: X7R; Voltage: 25V; Price: 0.1715; Device Package: 1210 (3225 Metric)
C19 = 293D106X0035D2TE3: CAP TANT 10UF 35V 20% 2917; Manufacturer: Vishay Sprague; TemperatureRange: -55C ~ 125C; Type: General Purpose; Value: 10uF; Part Number: 293D106X0035D2TE3; PartId: 6869; Supplier 1: Digi-Key; Supplier Part Number 1: 718-1046-2-ND; ComponentLink1Description: Datasheet; ComponentLink1URL: http://www.vishay.com/docs/40002/293d.pdf; ComponentLink2Description: Digi-Key listing; ComponentLink2URL: http://digikey.com/product-detail/en/293D106X0035D2TE3/718-1046-2-ND/1559398; Tolerance: 20%; Voltage: 35V; Price: 0.3563; Device Package: 2917 (7343 Metric)
C22 C26 = C3216X5R1E476M160AC: CAP CER 47UF 25V X5R 1206; Manufacturer: TDK Corporation; TemperatureRange: -55C ~ 85C; Tolerance: 20%; Value: 47uF; Part Number: C3216X5R1E476M160AC; PartId: 15844; Supplier 1: Digi-Key; Supplier Part Number 1: 445-8047-2-ND; ComponentLink1Description: Datasheet; ComponentLink1URL: https://product.tdk.com/info/en/catalog/datasheets/mlcc_commercial_general_en.pdf; ComponentLink2Description: Digi-Key Listing; ComponentLink2URL: https://www.digikey.com/product-detail/en/tdk-corporation/C3216X5R1E476M160AC/445-8047-2-ND/2792260; TemperatureCoefficient: X5R; Voltage: 25V; Price: 0.4883; Device Package: 1206 (3216 Metric)
C23 C27 = GRM155R71C104JA88D: as C2 on sheet TIASch; Value: 0.10uF; Part Number: GRM155R71C104JA88D; PartId: 12366; Supplier 1: Digi-Key; Supplier Part Number 1: 490-6327-2-ND; ComponentLink1Description: Datasheet; ComponentLink1URL: http://www.murata.com/~/media/webrenewal/support/library/catalog/products/capacitor/mlcc/c02e.pdf; ComponentLink2Description: Digi-Key Listing; ComponentLink2URL: https://www.digikey.com/product-detail/en/murata-electronics-north-america/GRM155R71C104JA88D/490-6327-2-ND/2610891; TemperatureCoefficient: X7R; Voltage: 16V; Price: 0.0046; Device Package: 0402 (1005 Metric)
EXT = 0022272031: CONN HEADER 3POS .100 VERT TIN; Manufacturer: Molex, LLC; Pitch: 0.100" (2.54mm); Number Of Positions: 3; Part Number: 0022272031; PartId: 9720; Supplier 1: Digi-Key; Supplier Part Number 1: WM4112-ND; ComponentLink1Description: Datasheet; ComponentLink1URL: http://www.molex.com/pdm_docs/sd/022272031_sd.pdf; ComponentLink2Description: Digi-Key Listing; ComponentLink2URL: http://www.digikey.com/product-search/en?keywords=22-27-2031; Price: 0.35; Type: Header, Unshrouded; Contact Finish: Tin; Fastening Type: Friction Lock; Number Of Rows: 1; Colour: Natural; Series: KK 6410
POW = CMP-1502-01784-1: Serie 3211 - 3.50mm Vertical PCB Header WR-TBL, 3 pin; Manufacturer: Wurth Elektronik; Pin Number: 3; Gender: Male; Datasheet URL: http://katalog.we-online.de/em/datasheet/6913211000xx.pdf; Package Reference: 691321100003; Pitch: 3.50mm; Publisher: WurthElektronik; Part Number: 691321100003; Mounting Technology: THT; Packaging: Box; Manufacturer URL: http://www.we-online.de; Operating Temperature: -40to105degC
R17 = ERJ-2RKF1332X: RES SMD 13.3K OHM 1% 1/10W 0402; Manufacturer: Panasonic Electronic Components; TemperatureRange: -55C ~ 155C; TemperatureCoefficient: 100ppm/C; PowerRating: 0.1W, 1/10W; Value: 13.3k; Part Number: ERJ-2RKF1332X; PartId: 334; Supplier 1: Digi-Key; Supplier Part Number 1: P13.3KLCT-ND; ComponentLink1Description: Datasheet; ComponentLink1URL: http://industrial.panasonic.com/www-cgi/jvcr13pz.cgi?E+PZ+3+AOA0002+ERJ2RKF1332X+7+WW; ComponentLink2Description: Digikey listing; ComponentLink2URL: http://digikey.com/product-detail/en/ERJ-2RKF1332X/P13.3KLTR-ND/192120; Tolerance: 1%; Price: 0.0043; Type: Thick Film; Device Package: 0402 (1005 Metric)
R18 = ERJ-2RKF2322X: RES SMD 23.2K OHM 1% 1/10W 0402; Manufacturer: Panasonic Electronic Components; TemperatureRange: -55C ~ 155C; TemperatureCoefficient: 100ppm/C; PowerRating: 0.1W, 1/10W; Value: 23.2k; Part Number: ERJ-2RKF2322X; PartId: 287; Supplier 1: Digi-Key; Supplier Part Number 1: P23.2KLTR-ND; ComponentLink1Description: Datasheet; ComponentLink1URL: http://industrial.panasonic.com/www-cgi/jvcr13pz.cgi?E+PZ+3+AOA0002+ERJ2RKF2322X+7+WW; ComponentLink2Description: Digikey listing; ComponentLink2URL: http://digikey.com/product-detail/en/ERJ-2RKF2322X/P23.2KLTR-ND/192235; Tolerance: 1%; Price: 0.0043; Type: Thick Film; Device Package: 0402 (1005 Metric)
R19 = ERJ-2RKF1502X: RES SMD 15K OHM 1% 1/10W 0402; Manufacturer: Panasonic Electronic Components; TemperatureRange: -55C ~ 155C; TemperatureCoefficient: 100ppm/C; PowerRating: 0.1W, 1/10W; Value: 15k; Part Number: ERJ-2RKF1502X; PartId: 12216; Supplier 1: Digi-Key; Supplier Part Number 1: P15.0KLCT-ND; ComponentLink1Description: Datasheet; ComponentLink1URL: http://industrial.panasonic.com/www-cgi/jvcr13pz.cgi?E+PZ+3+AOA0002+ERJ2RKF1502X+7+WW; ComponentLink2Description: Digi-Key Listing; ComponentLink2URL: https://www.digikey.com/product-detail/en/panasonic-electronic-components/ERJ-2RKF1502X/P15.0KLTR-ND/192143; Tolerance: 1%; Price: 0.0028; Device Package: 0402 (1005 Metric)
R20 = ERJ-2RKF4752X: RES SMD 47.5K OHM 1% 1/10W 0402; Manufacturer: Panasonic Electronic Components; TemperatureRange: -55C ~ 155C; TemperatureCoefficient: 100ppm/C; PowerRating: 0.1W, 1/10W; Value: 47.5k; Part Number: ERJ-2RKF4752X; PartId: 180; Supplier 1: Digi-Key; Supplier Part Number 1: P47.5KLTR-ND; ComponentLink1Description: Datasheet; ComponentLink1URL: http://industrial.panasonic.com/www-cgi/jvcr13pz.cgi?E+PZ+3+AOA0002+ERJ2RKF4752X+7+WW; ComponentLink2Description: Digikey listing; ComponentLink2URL: http://digikey.com/product-detail/en/ERJ-2RKF4752X/P47.5KLTR-ND/192375; Tolerance: 1%; Price: 0.0043; Type: Thick Film; Device Package: 0402 (1005 Metric)
R21 R23 = ERJ-2RKF1200X: RES SMD 120 OHM 1% 1/10W 0402; Manufacturer: Panasonic Electronic Components; TemperatureRange: -55C ~ 155C; TemperatureCoefficient: 100ppm/C; PowerRating: 0.1W, 1/10W; Value: 120; Part Number: ERJ-2RKF1200X; PartId: 12223; Supplier 1: Digi-Key; Supplier Part Number 1: P120LTR-ND; ComponentLink1Description: Datasheet; ComponentLink1URL: http://industrial.panasonic.com/www-cgi/jvcr13pz.cgi?E+PZ+3+AOA0002+ERJ2RKF1200X+7+WW; ComponentLink2Description: Digi-Key Listing; ComponentLink2URL: https://www.digikey.com/product-detail/en/panasonic-electronic-components/ERJ-2RKF1200X/P120LTR-ND/1746117; Tolerance: 1%; Price: 0.0028; Device Package: 0402 (1005 Metric)
R22 R24 = ERJ-2RKF3600X: RES SMD 360 OHM 1% 1/10W 0402; Manufacturer: Panasonic Electronic Components; TemperatureRange: -55C ~ 155C; TemperatureCoefficient: 100ppm/C; PowerRating: 0.1W, 1/10W; Value: 360; Part Number: ERJ-2RKF3600X; PartId: 445; Supplier 1: Digi-Key; Supplier Part Number 1: P360LTR-ND; ComponentLink1Description: Datasheet; ComponentLink1URL: http://industrial.panasonic.com/www-cgi/jvcr13pz.cgi?E+PZ+3+AOA0002+ERJ2RKF3600X+7+WW; ComponentLink2Description: Digikey listing; ComponentLink2URL: http://digikey.com/product-detail/en/ERJ-2RKF3600X/P360LTR-ND/1746200; Tolerance: 1%; Price: 0.0043; Type: Thick Film; Device Package: 0402 (1005 Metric)
R25 = ERJ-2RKF2003X: RES SMD 200K OHM 1% 1/10W 0402; Manufacturer: Panasonic Electronic Components; TemperatureRange: -55C ~ 155C; TemperatureCoefficient: 100ppm/C; PowerRating: 0.1W, 1/10W; Value: 200k; Part Number: ERJ-2RKF2003X; PartId: 17; Supplier 1: Digi-Key; Supplier Part Number 1: P200KLCT-ND; ComponentLink1Description: Datasheet; ComponentLink1URL: http://industrial.panasonic.com/www-cgi/jvcr13pz.cgi?E+PZ+3+AOA0002+ERJ2RKF2003X+7+WW; ComponentLink2Description: Digikey listing; ComponentLink2URL: http://digikey.com/product-detail/en/ERJ-2RKF2003X/P200KLTR-ND/192216; Tolerance: 1%; Price: 0.0043; Type: Thick Film; Device Package: 0402 (1005 Metric)
R26 = ERJ-2RKF1103X: RES SMD 110K OHM 1% 1/10W 0402; Manufacturer: Panasonic Electronic Components; TemperatureRange: -55C ~ 155C; TemperatureCoefficient: 100ppm/C; PowerRating: 0.1W, 1/10W; Value: 110k; Part Number: ERJ-2RKF1103X; PartId: 175; Supplier 1: Digi-Key; Supplier Part Number 1: P110KLTR-ND; ComponentLink1Description: Datasheet; ComponentLink1URL: http://industrial.panasonic.com/www-cgi/jvcr13pz.cgi?E+PZ+3+AOA0002+ERJ2RKF1103X+7+WW; ComponentLink2Description: Digikey listing; ComponentLink2URL: http://digikey.com/product-detail/en/ERJ-2RKF1103X/P110KLTR-ND/192097; Tolerance: 1%; Price: 0.0043; Type: Thick Film; Device Package: 0402 (1005 Metric)
R27 = ERJ-2RKF3323X: RES SMD 332K OHM 1% 1/10W 0402; Manufacturer: Panasonic Electronic Components; TemperatureRange: -55C ~ 155C; TemperatureCoefficient: 100ppm/C; PowerRating: 0.1W, 1/10W; Value: 332k; Part Number: ERJ-2RKF3323X; PartId: 225; Supplier 1: Digi-Key; Supplier Part Number 1: P332KLTR-ND; ComponentLink1Description: Datasheet; ComponentLink1URL: http://industrial.panasonic.com/www-cgi/jvcr13pz.cgi?E+PZ+3+AOA0002+ERJ2RKF3323X+7+WW; ComponentLink2Description: Digikey listing; ComponentLink2URL: http://digikey.com/product-detail/en/ERJ-2RKF3323X/P332KLTR-ND/192308; Tolerance: 1%; Price: 0.0043; Type: Thick Film; Device Package: 0402 (1005 Metric)
R28 = ERJ-2RKF1023X: RES SMD 102K OHM 1% 1/10W 0402; Manufacturer: Panasonic Electronic Components; TemperatureRange: -55C ~ 155C; TemperatureCoefficient: 100ppm/C; PowerRating: 0.1W, 1/10W; Value: 102k; Part Number: ERJ-2RKF1023X; PartId: 200; Supplier 1: Digi-Key; Supplier Part Number 1: P102KLTR-ND; ComponentLink1Description: Datasheet; ComponentLink1URL: http://industrial.panasonic.com/www-cgi/jvcr13pz.cgi?E+PZ+3+AOA0002+ERJ2RKF1023X+7+WW; ComponentLink2Description: Digikey listing; ComponentLink2URL: http://digikey.com/product-detail/en/ERJ-2RKF1023X/P102KLTR-ND/192083; Tolerance: 1%; Price: 0.0043; Type: Thick Film; Device Package: 0402 (1005 Metric)
U5 U6 = LP38798SDE-ADJ/NOPB: IC REG LIN POS ADJ 800MA 12WSON; Built_By: EMA_UL_Team; Vendor: Texas Instruments; Topology: Positive Adjustable; Manufacturer_Part_Number: LP38798SDE-ADJ/NOPB; Copyright: Copyright (C) 2018 Accelerated Designs. All rights reserved; RefDes: RefDes; Type: DEV; Value: Value; Part Number: LP38798SDE-ADJ/NOPB; PartId: 7965; Manufacturer: Texas Instruments; Supplier 1: Digi-Key; Supplier Part Number 1: 296-36225-1-ND; ComponentLink1Description: Datasheet; ComponentLink1URL: http://www.ti.com/lit/ds/symlink/lp38798.pdf; ComponentLink2Description: Digi-Key Listing; ComponentLink2URL: https://www.digikey.com/product-detail/en/texas-instruments/LP38798SDE-ADJ-NOPB/296-36225-1-ND/4240231; Price: 3.59; Device Package: 12-WSON (4x4)
U7 = CMP-0062-02498-3: 3-Amp Adjustable Regulator, 3-pin TO-220; Manufacturer: Texas Instruments; CompType: LDO IC; PowerWise: N; PackageTopMarking: NSUZXYTTE#*LM350T P+; PackageDescription: TO-220, Molded, 3 Lead, Straight; ComponentLink1URL: http://www.ti.com/general/docs/lit/getliterature.tsp?genericPartNumber=LM350-N&fileType=pdf; PinCount: 3; PackageReference: NDE0003A; RoHS: N; ComponentLink1Description: Datasheet URL
U8 = CMP-0062-02479-3: 3-Terminal Adjustable Negative Regulator, 3-pin TO-220, Pb-Free; Manufacturer: Texas Instruments; CompType: LDO IC; PowerWise: N; PackageTopMarking: NSUZXYTTE#*LM337T P+; PinCount: 3; RoHS: Y; ComponentLink1Description: Datasheet URL; ComponentLink1URL: http://www.ti.com/general/docs/lit/getliterature.tsp?genericPartNumber=LM337-N&fileType=pdf; PackageReference: NDE0003A; PackageDescription: TO-220, Molded, 3 Lead, Straight
U9 U10 = CMP-0395-01390-2: Single Output High PSRR LDO, 1 A, Adjustable -1.18 to -33 V Output, -3 to -36 V Input, with Ultra-Low Noise, 20-pin VQFN (RGW), -40 to 125 degC, Green (RoHS & no Sb/Br); Manufacturer: Texas Instruments; Iq(Typ)(mA): 0.21; Accuracy(%): 1.5; Iout(Max)(A): 1; SubFamily: Single Channel LDO; Vdo(Typ)(mV): 290; Vin(Max)(V): -36; ComponentLink3URL: http://www.ti.com/litv/pdf/mpqf122b; ComponentLink3Description: Package Specification; Code_JEDEC: MO-220; ComponentLink2Description: Datasheet; ComponentLink2URL: http://www.ti.com/general/docs/lit/getliterature.tsp?genericPartNumber=TPS7A3301&fileType=pdf; Vout Adj(Min)(V): -1.18; PackageDescription: 20-Pin Plastic Quad Flat No-Pin, 5 x 5 mm Body, 0.65 mm Pitch, 3.15 x 3.15 mm Exposed Pad; ComponentLink1URL: http://www.ti.com/; ComponentLink1Description: Manufacturer URL; Eco-Plan: Green (RoHS & no Sb/Br); PackageReference: RGW0020A; PartNumber: TPS7A3301RGWT; DatasheetVersion: SBVS169B; Vin(Min)(V): -3; Mounting Technology: Surface Mount; Vout Adj(Max)(V): -33

## Nets that join several sheets
+3.3: DetectionSch (R31.1), TIASch (8 pins), DiffAmp (8 pins), VSupply3 (C15.2 U5.10 U5.11 U5.12)
+5: U_MonAmpA (C10A.2 U3A.3), U_MonAmpB (C10B.2 U3B.3), U_BufferA (C28A.2 U4A.8), U_BufferB (C28B.2 U4B.8), VSupply3 (C18.2 U6.10 U6.11 U6.12)
-3.3: DetectionSch (R32.1), VSupply3 (5 pins)
-5: U_BufferA (C29A.2 U4A.4), U_BufferB (C29B.2 U4B.4), VSupply3 (5 pins)
GND: DetectionSch (D1.2 D2.2), TIASch (14 pins), DiffAmp (9 pins), SingEndOutput (OUT.G XRF.6), U_MonAmpA (C10A.1 U3A.1 U3A.2), U_MonAmpB (C10B.1 U3B.1 U3B.2), U_BufferA (C28A.1 C29A.1 MONA.G R29A.1), U_BufferB (C28B.1 C29B.1 MONB.G R29B.1), VSupply3 (31 pins)
BS_N: TIASch (R5.1), DiffAmp (R9.1 U2.3)
BS_P: TIASch (R6.1), DiffAmp (R8.1 U2.2)
FS_N: LPFilter (L7.2 R15.1), SingEndOutput (XRF.1)
FS_P: LPFilter (L3.2 R14.2), SingEndOutput (XRF.3)
MonA_N: DetectionSch (D1.1 R1.2), U_MonAmpA (U3A.5)
MonA_P: DetectionSch (R1.1 R31.2), U_MonAmpA (U3A.4)
MonB_N: DetectionSch (R2.1 R32.2), U_MonAmpB (U3B.5)
MonB_P: DetectionSch (D2.3 R2.2), U_MonAmpB (U3B.4)
NetD1_3: DetectionSch (D1.3 D2.1), TIASch (U1.15)
NetU3A_6: U_MonAmpA (U3A.6), U_BufferA (U4A.5)
NetU3B_6: U_MonAmpB (U3B.6), U_BufferB (U4B.5)
OUT_N: DiffAmp (U2.11), LPFilter (R16.1)
OUT_P: DiffAmp (U2.10), LPFilter (R13.1)